# EAGLE design leg_controller (EAGLE 7.7.0)
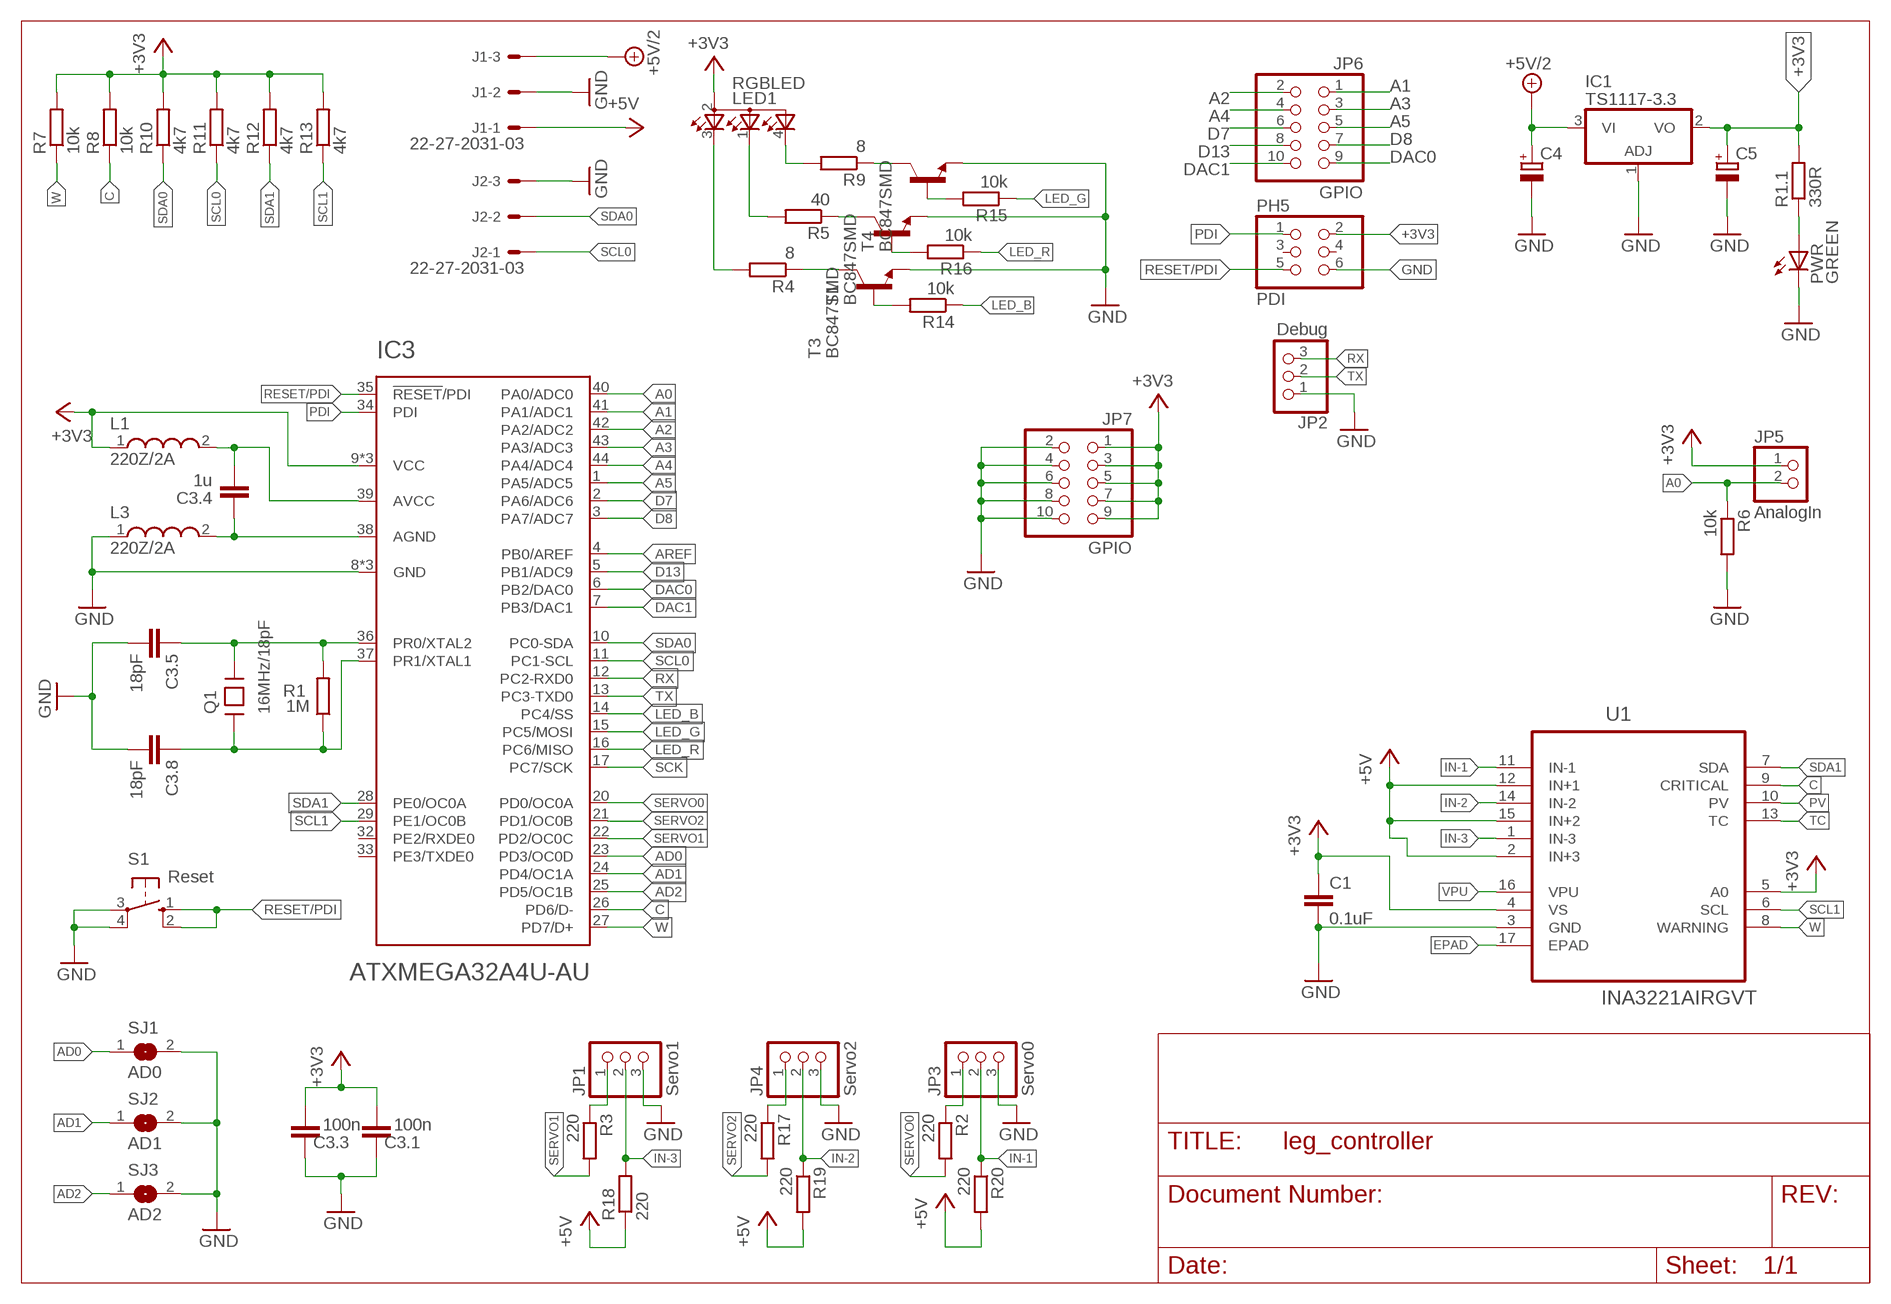
[diagram p0: schematic, sheet 1]

## Parts
C1  0.1uF  C-EUC0805  [C0805]
C3.1  100n  C-EUC0805K  [C0805K]
C3.3  100n  C-EUC0805K  [C0805K]
C3.4  1u  C-EUC0805K  [C0805K]
C3.5  18pF  C-EUC0805K  [C0805K]
C3.8  18pF  C-EUC0805K  [C0805K]
C4  CPOL-EUSMCA  [SMC_A]
C5  CPOL-EUSMCA  [SMC_A]
IC1  TS1117-3.3  MC33269D-3.3  [DPACK]
IC3  ATXMEGA32A4U-AU  [TQFP-44A-44]
J1  22-27-2031-03  [6410-03]
J2  22-27-2031-03  [6410-03]
JP1  Servo1  PINHD-1X3  [1X03]
JP2  Debug  PINHD-1X3  [1X03]
JP3  Servo0  PINHD-1X3  [1X03]
JP4  Servo2  PINHD-1X3  [1X03]
JP5  AnalogIn  PINHD-1X2  [1X02]
JP6  GPIO  PINHD-2X5  [2X05]
JP7  GPIO  PINHD-2X5  [2X05]
L1  220Z/2A  WE-CBF_0805(WB/HS)  [WE-CBF_0805(W=3.0)]
L3  220Z/2A  WE-CBF_0805(WB/HS)  [WE-CBF_0805(W=3.0)]
LED1  RGBLED  [P-LCC4-RGB]
PH5  PDI  PINHD-2X3  [2X03]
PWR  GREEN  LEDCHIP-LED0805  [CHIP-LED0805]
Q1  16MHz/18pF  CRYSTAL-ABRACON-ABM3-SMD  [CRYSTAL-ABRACON-ABM3-SMD]
R1  1M  R-EU_R0805  [R0805]
R1.1  330R  R-EU_R0805  [R0805]
R2  220  R-EU_R0805  [R0805]
R3  220  R-EU_R0805  [R0805]
R4  8  R-EU_R0805  [R0805]
R5  40  R-EU_R0805  [R0805]
R6  10k  R-EU_M0805  [M0805]
R7  10k  R-EU_R0805  [R0805]
R8  10k  R-EU_R0805  [R0805]
R9  8  R-EU_R0805  [R0805]
R10  4k7  R-EU_R0805  [R0805]
R11  4k7  R-EU_R0805  [R0805]
R12  4k7  R-EU_R0805  [R0805]
R13  4k7  R-EU_R0805  [R0805]
R14  10k  R-EU_R0805  [R0805]
R15  10k  R-EU_R0805  [R0805]
R16  10k  R-EU_R0805  [R0805]
R17  220  R-EU_R0805  [R0805]
R18  220  R-EU_R1206  [R1206]
R19  220  R-EU_R1206  [R1206]
R20  220  R-EU_R1206  [R1206]
S1  Reset  10-XX  [B3F-10XX]
SJ1  AD0  SJ  [SJ]
SJ2  AD1  SJ  [SJ]
SJ3  AD2  SJ  [SJ]
T1  BC847SMD  [SOT23]
T3  BC847SMD  [SOT23]
T4  BC847SMD  [SOT23]
U1  INA3221AIRGVT  [QFN65P400X400X80-17N]

## Nets
+3V3: C1.1 C3.1.1 C3.3.1 C5.+ IC1.2(VO) IC3.9(VCC) IC3.19(VCC) IC3.31(VCC) JP5.1 JP7.1 JP7.3 JP7.5 JP7.7 JP7.9 L1.1 LED1.2(A2) PH5.2 R1.1.2 R7.2 R8.2 R10.2 R11.2 R12.2 R13.2 U1.4(VS) U1.5(A0)
+5V: J1.1 R18.1 R19.2 R20.2 U1.2(IN+3) U1.12(IN+1) U1.15(IN+2)
+5V/2: C4.+ IC1.3(VI) J1.3
A0: IC3.40(PA0/ADC0) JP5.2 R6.1
A1: IC3.41(PA1/ADC1) JP6.1
A2: IC3.42(PA2/ADC2) JP6.2
A3: IC3.43(PA3/ADC3) JP6.3
A4: IC3.44(PA4/ADC4) JP6.4
A5: IC3.1(PA5/ADC5) JP6.5
AD0: IC3.23(PD3/OC0D) SJ1.1
AD1: IC3.24(PD4/OC1A) SJ2.1
AD2: IC3.25(PD5/OC1B) SJ3.1
AGND: C3.4.2 IC3.38(AGND) L3.2
AREF: IC3.4(PB0/AREF)
C: IC3.26(PD6/D-) R8.1 U1.9(CRITICAL)
D7: IC3.2(PA6/ADC6) JP6.6
D8: IC3.3(PA7/ADC7) JP6.7
D13: IC3.5(PB1/ADC9) JP6.8
DAC0: IC3.6(PB2/DAC0) JP6.9
DAC1: IC3.7(PB3/DAC1) JP6.10
EPAD: U1.17(EPAD)
GND: C1.2 C3.1.2 C3.3.2 C3.5.2 C3.8.2 C4.- C5.- IC1.1(ADJ) IC3.8(GND) IC3.18(GND) IC3.30(GND) J1.2 J2.3 JP1.3 JP2.1 JP3.3 JP4.3 JP7.2 JP7.4 JP7.6 JP7.8 JP7.10 L3.1 PH5.6 PWR.C R6.2 S1.3(P) S1.4(P1) SJ1.2 SJ2.2 SJ3.2 T1.2(E) T3.2(E) T4.2(E) U1.3(GND)
IN-1: JP3.2 R20.1 U1.11(IN-1)
IN-2: JP4.2 R19.1 U1.14(IN-2)
IN-3: JP1.2 R18.2 U1.1(IN-3)
LED_B: IC3.14(PC4/SS) R14.1
LED_G: IC3.15(PC5/MOSI) R15.1
LED_R: IC3.16(PC6/MISO) R16.1
N$8: C3.4.1 IC3.39(AVCC) L1.2
N$13: R5.1 T1.3(C)
N$14: R4.1 T3.3(C)
N$15: R9.1 T4.3(C)
N$16: PWR.A R1.1.1
N$17: LED1.3(CRED) R4.2
N$18: JP3.1 R2.1
N$19: JP1.1 R3.1
N$20: LED1.1(CBLUE) R5.2
N$21: LED1.4(CGREEN) R9.2
N$22: JP4.1 R17.1
N$27: R14.2 T3.1(B)
N$28: R15.2 T4.1(B)
N$29: R16.2 T1.1(B)
PDI: IC3.34(PDI) PH5.1
PV: U1.10(PV)
RESET/PDI: IC3.35(!RESET!/PDI) PH5.5 S1.1(S) S1.2(S1)
RX: IC3.12(PC2-RXD0) JP2.3
SCK: IC3.17(PC7/SCK)
SCL0: IC3.11(PC1-SCL) J2.1 R11.1
SCL1: IC3.29(PE1/OC0B) R13.1 U1.6(SCL)
SDA0: IC3.10(PC0-SDA) J2.2 R10.1
SDA1: IC3.28(PE0/OC0A) R12.1 U1.7(SDA)
SERVO0: IC3.20(PD0/OC0A) R2.2
SERVO1: IC3.22(PD2/OC0C) R3.2
SERVO2: IC3.21(PD1/OC0B) R17.2
TC: U1.13(TC)
TX: IC3.13(PC3-TXD0) JP2.2
VPU: U1.16(VPU)
W: IC3.27(PD7/D+) R7.1 U1.8(WARNING)
XTAL1R: C3.8.1 IC3.37(PR1/XTAL1) Q1.P$1 R1.1
XTAL2: C3.5.1 IC3.36(PR0/XTAL2) Q1.P$2 R1.2
Unconnected: IC3.32(PE2/RXDE0) IC3.33(PE3/TXDE0) PH5.3 PH5.4

## Library data of the parts
C1 C3.1 C3.3-C3.5 C3.8 = rcl:C-EU: CAPACITOR, European symbol
C4 C5 = rcl:CPOL-EU: POLARIZED CAPACITOR, European symbol
IC1 = linear:MC33269?*: Adjustable Output Low Dropout Voltage Regulator 800 mA Source: http://www.onsemi.com/pub/Collateral/MC33269-D.PDF
IC3 = atmel-xmega:ATXMEGA32A4U: 8/16-bit XMEGA A4U Microcontroller Features High-performance, low-power Atmel® AVR® XMEGA® 8/16-bit Microcontroller Nonvolatile program and data memories – 16K - 128KBytes of in-system self-programmable flash – 4K - 8KBytes boot section – 1K - 2KBytes EEPROM – 2K - 8KBytes internal SRAM Peripheral Features – Four-channel DMA controller – Eight-channel event system – Five 16-bit timer/counters Three timer/counters with 4 output compare or input capture channels Two timer/counters with 2 output compare or input capture channels High-resolution extensions on all timer/counters Advanced waveform extension (AWeX) on one timer/counter – One USB device interface USB 2.0 full speed (12Mbps) and low speed (1.5Mbps) device compliant 32 Endpoints with full configuration flexibility – Five USARTs with IrDA support for one USART – Two Two-wire interfaces with dual address match (I2C and SMBus compatible) – Two serial peripheral interfaces (SPIs) – AES and DES crypto engine – CRC-16 (CRC-CCITT) and CRC-32 (IEEE® 802.3) generator – 16-bit real time counter (RTC) with separate oscillator – One twelve-channel, 12-bit, 2mspsAnalog to Digital Converter – One two-channel, 12-bit, 1msps Digital to Analog Converter – Two Analog Comparators with window compare function, and current sources – External interrupts on all general purpose I/O pins – Programmable watchdog timer with separate on-chip ultra low power oscillator – QTouch® library support Capacitive touch buttons, sliders and wheels Special microcontroller features – Power-on reset and programmable brown-out detection – Internal and external clock options with PLL and prescaler – Programmable multilevel interrupt controller – Five sleep modes – Programming and debug interfaces PDI (program and debug interface) I/O and packages – 34 Programmable I/O pins – 44 - lead TQFP – 44 - pad VQFN/QFN – 49 - ball VFBGA Operating voltage – 1.6 – 3.6V Operating frequency – 0 – 12MHz from 1.6V – 0 – 32MHz from 2.7V
J1 J2 = con-molex:22-?-03: CONNECTOR wire to board 2.54 mm (.1 inch) pitch header; OC_FARNELL: unknown; OC_NEWARK: unknown
JP1 JP3 JP4 = pinhead:PINHD-1X3: PIN HEADER
JP2 = pinhead_NEW:PINHD-1X3: PIN HEADER
JP5 = pinhead:PINHD-1X2: PIN HEADER
JP6 JP7 = pinhead:PINHD-2X5: PIN HEADER
L1 L3 = Wurth_Elektronik_Passive_rev15d:WE-CBF: WE-CBF SMD EMI Suppression Ferrite Bead Characteristics Reliable Ni-Sn electrodes High rated current up to 6 A Operating temperature: –55 ºC to +125 ºC Applications Perfect as data lined filter and for uncoupling of distribution voltage Variant abbreviation WB means WIDE BAND HS means HIGH SPEED HC means HIGH CURRENT <http://katalog.we-online.de/media/images/eisos/FeCBF_pf2.jpg> Details see: http://katalog.we-online.de/en/pbs/WE-CBF Updated on 2014-06-19 2014 (C) Wurth Elektronik
LED1 = led:RGBLED
PH5 = pinhead:PINHD-2X3: PIN HEADER
PWR = led:LED: LED OSRAM: - CHIPLED LG R971, LG N971, LY N971, LG Q971, LY Q971, LO R971, LY R971 LH N974, LH R974 LS Q976, LO Q976, LY Q976 LO Q996 - Hyper CHIPLED LW Q18S LB Q993, LB Q99A, LB R99A - SideLED LS A670, LO A670, LY A670, LG A670, LP A670 LB A673, LV A673, LT A673, LW A673 LH A674 LY A675 LS A676, LA A676, LO A676, LY A676, LW A676 LS A679, LY A679, LG A679 - Hyper Micro SIDELED® LS Y876, LA Y876, LO Y876, LY Y876 LT Y87S - SmartLED LW L88C, LW L88S LB L89C, LB L89S, LG L890 LS L89K, LO L89K, LY L89K LS L896, LA L896, LO L896, LY L896 - TOPLED LS T670, LO T670, LY T670, LG T670, LP T670 LSG T670, LSP T670, LSY T670, LOP T670, LYG T670 LG T671, LOG T671, LSG T671 LB T673, LV T673, LT T673, LW T673 LH T674 LS T676, LA T676, LO T676, LY T676, LB T676, LH T676, LSB T676, LW T676 LB T67C, LV T67C, LT T67C, LS T67K, LO T67K, LY T67K, LW E67C LS E67B, LA E67B, LO E67B, LY E67B, LB E67C, LV E67C, LT E67C LW T67C LS T679, LY T679, LG T679 LS T770, LO T770, LY T770, LG T770, LP T770 LB T773, LV T773, LT T773, LW T773 LH T774 LS E675, LA E675, LY E675, LS T675 LS T776, LA T776, LO T776, LY T776, LB T776 LHGB T686 LT T68C, LB T68C - Hyper Mini TOPLED® LB M676 - Mini TOPLED Santana® LG M470 LS M47K, LO M47K, LY M47K Source: http://www.osram.convergy.de LUXEON: - LUMILED® LXK2-PW12-R00, LXK2-PW12-S00, LXK2-PW14-U00, LXK2-PW14-V00 LXK2-PM12-R00, LXK2-PM12-S00, LXK2-PM14-U00 LXK2-PE12-Q00, LXK2-PE12-R00, LXK2-PE12-S00, LXK2-PE14-T00, LXK2-PE14-U00 LXK2-PB12-K00, LXK2-PB12-L00, LXK2-PB12-M00, LXK2-PB14-N00, LXK2-PB14-P00, LXK2-PB14-Q00 LXK2-PR12-L00, LXK2-PR12-M00, LXK2-PR14-Q00, LXK2-PR14-R00 LXK2-PD12-Q00, LXK2-PD12-R00, LXK2-PD12-S00 LXK2-PH12-R00, LXK2-PH12-S00 LXK2-PL12-P00, LXK2-PL12-Q00, LXK2-PL12-R00 Source: www.luxeon.com KINGBRIGHT: KA-3528ASYC Source: www.kingbright.com
Q1 = crystal-abracon-abm3-smd:CRYSTAL-ABRACON-ABM3-SMD: ABRACON ABM3-8.000MHZ-D2Y-T QUARZ 8MHZ 18PF SMD, 5mm x 3.2mm Frequenzstabilität + / -: 30ppm Frequenztoleranz + / -: 20ppm; FARNELL: 2101329
R1 R1.1 R2-R20 = rcl:R-EU_: RESISTOR, European symbol
S1 = switch-omron:10-XX: OMRON SWITCH; MPN: B3F-1000; OC_FARNELL: 176432; OC_NEWARK: 36M3542
SJ1-SJ3 = jumper:SJ: SMD solder JUMPER
T1 T3 T4 = transistor-npn:BC847*: NPN Transistor
U1 = TexasInstruments:INA3221AIRGVT: MONITOR, 3CH, HS, 0V TO 26VSENSE, 16QFN; MPN: INA3221AIRGVT; OC_FARNELL: 2144251; OC_NEWARK: 27W5216; PACKAGE: 16QFN; SUPPLIER: TEXAS INSTRUMENTS

## Board
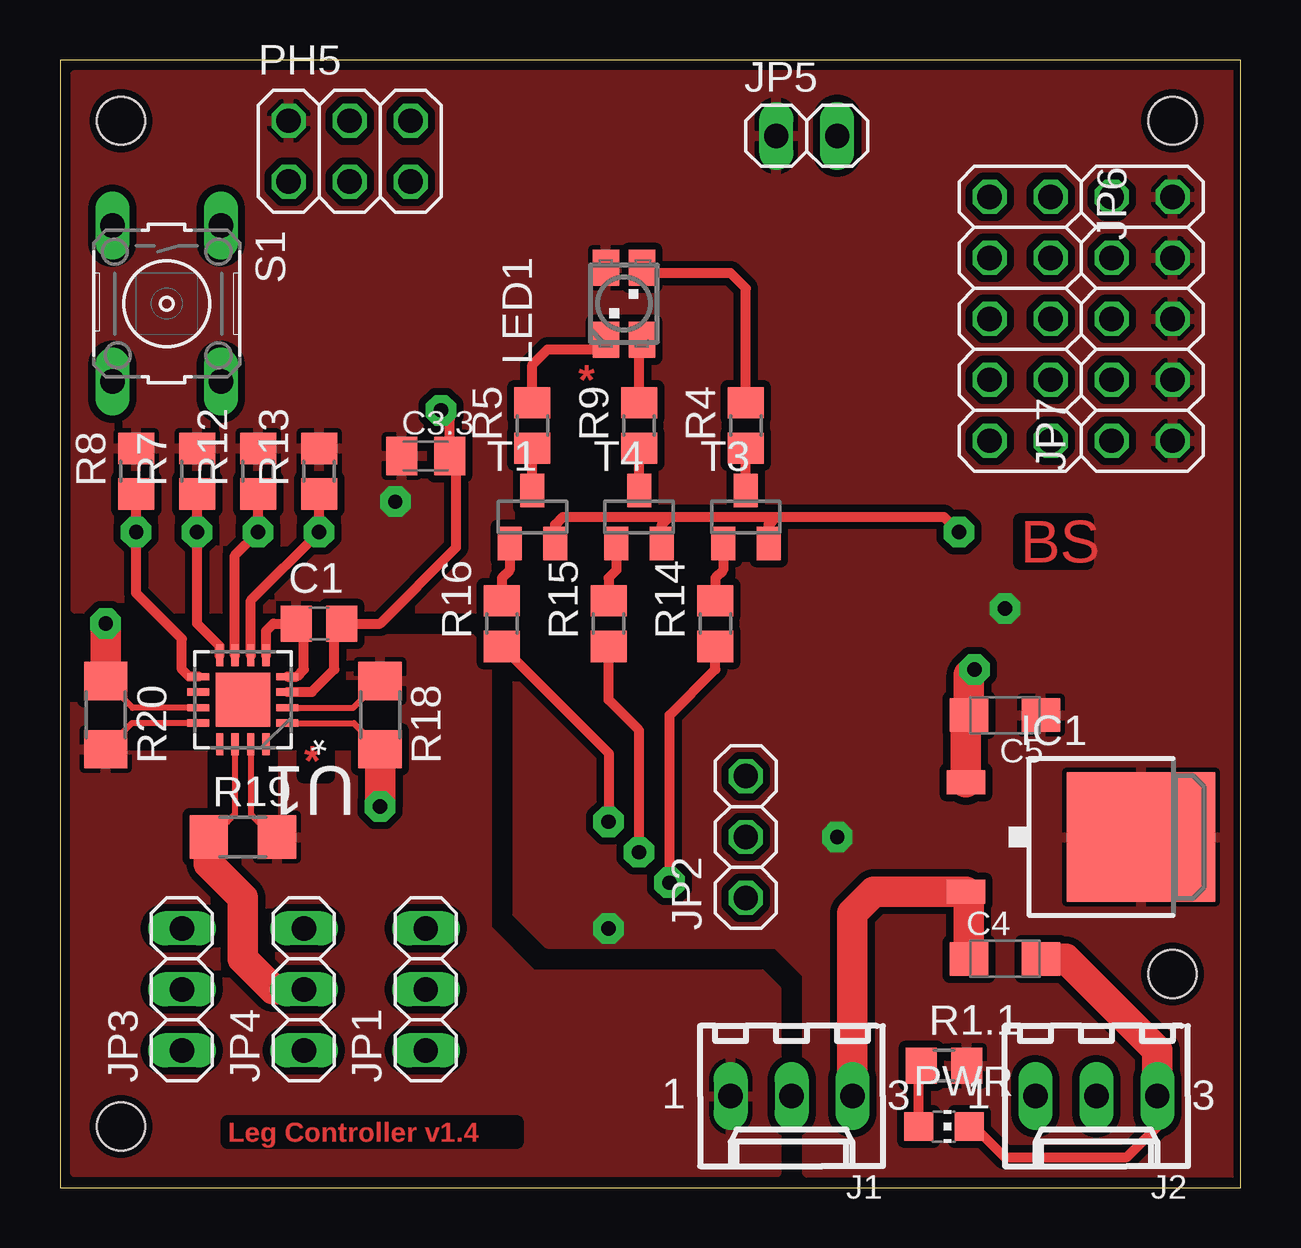
[diagram p1: board, top side]
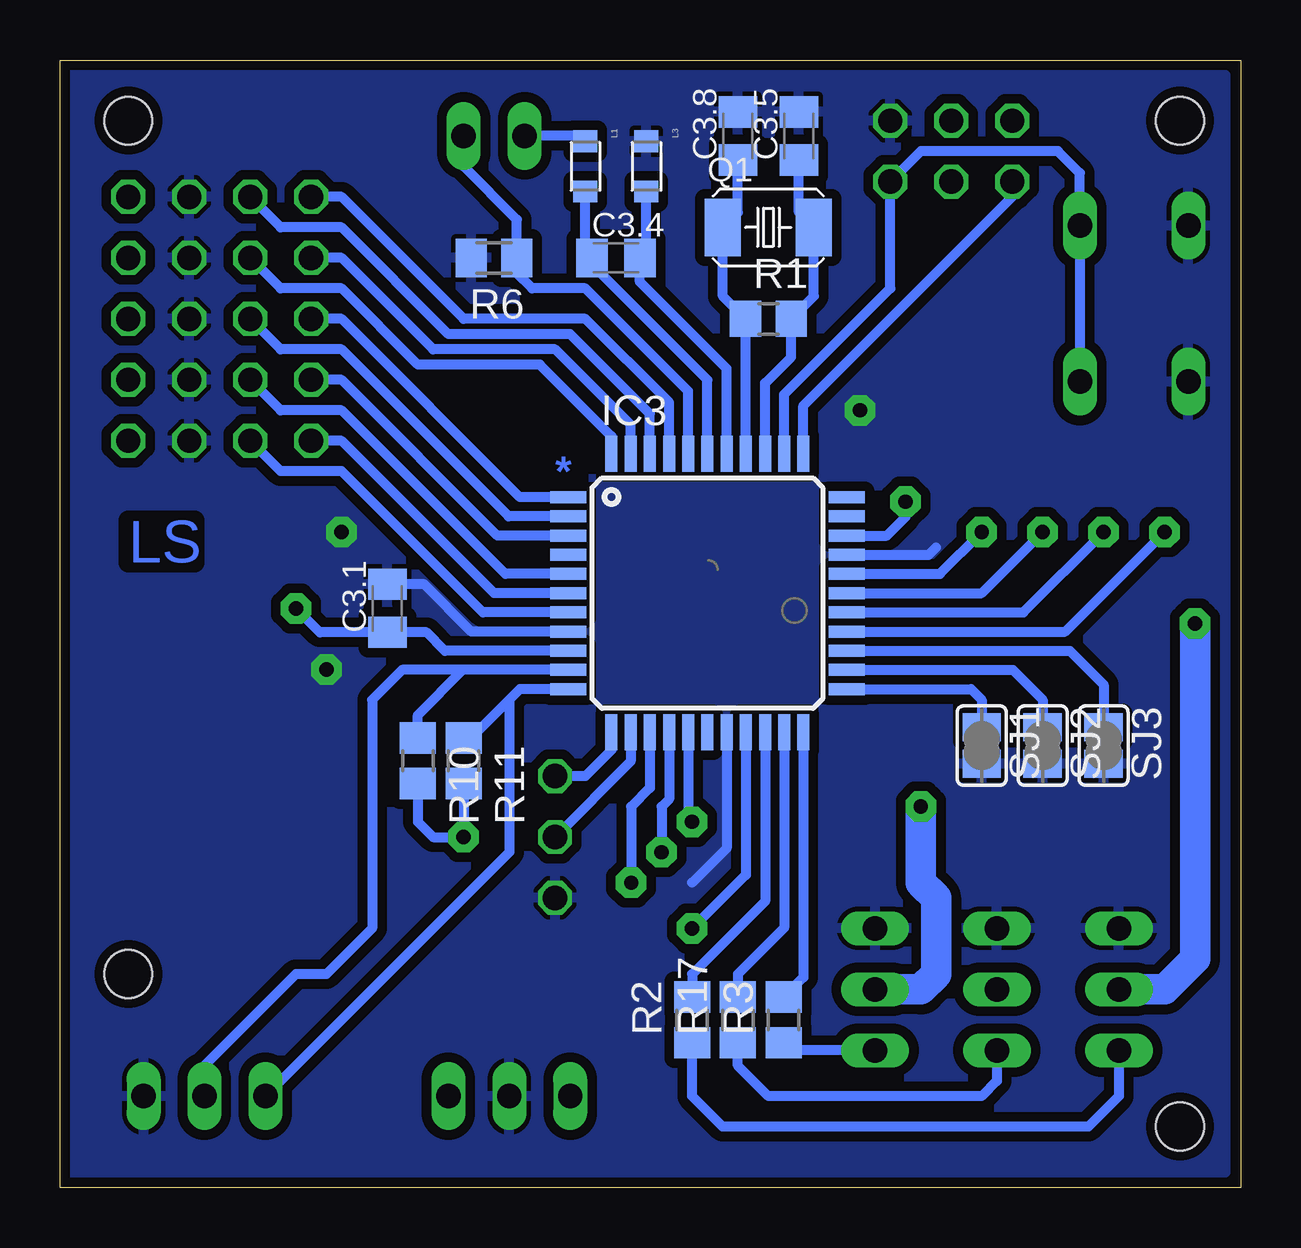
[diagram p2: board, bottom side, seen from below]

Size 49.2 x 46.98 mm. Coordinates in mm from the lower left corner, seen from the top.
Outline: 0,0 49.2,0 49.2,46.98 0,46.98 0,0
Copper layers (1*16): Top 0.035mm / dielectric 1.5mm / Bottom 0.035mm
Design rules "PCB-POOL Standard": minimum track width 0.15mm, minimum drill 0.3mm, track to track 0.15mm, track to pad 0.15mm, pad to pad 0.15mm, via to via 0.15mm, smd to smd 0.15mm, copper to edge 0.3mm, drill to drill 0.2mm, minimum pad ring 0.2mm, minimum via ring 0.15mm, stop-mask expansion 0.075mm, vias tented up to drill 0mil, thermal gap 0.2mm
Holes 2 mm at 2.54,2.54 46.35,44.45 2.54,44.45 46.35,8.89

### Footprints (pad centres in the part's own frame; a part is rotated, then mirrored left to right if it is on the bottom)
C0805 = smd 1.3 x 1.5: 1 -0.95,0; 2 0.95,0
C0805K = smd 1.3 x 1.6: 1 -1,0; 2 1,0
SMC_A = smd 1.6 x 1.4: + -1.5,0; - 1.5,0
DPACK = smd 1 x 1.6: 1 -2.28,-4.8; 3 2.28,-4.8 | smd 5.4 x 6.2: 2 0,2.5
TQFP-44A-44 = smd 1.5 x 0.5: 1 -5.8,4; 2 -5.8,3.2; 3 -5.8,2.4; 4 -5.8,1.6; 5 -5.8,0.8; 6 -5.8,0; 7 -5.8,-0.8; 8 -5.8,-1.6; 9 -5.8,-2.4; 10 -5.8,-3.2; 11 -5.8,-4; 23 5.8,-4; 24 5.8,-3.2; 25 5.8,-2.4; 26 5.8,-1.6; 27 5.8,-0.8; 28 5.8,0; 29 5.8,0.8; 30 5.8,1.6; 31 5.8,2.4; 32 5.8,3.2; 33 5.8,4 | smd 0.5 x 1.5: 12 -4,-5.8; 13 -3.2,-5.8; 14 -2.4,-5.8; 15 -1.6,-5.8; 16 -0.8,-5.8; 17 0,-5.8; 18 0.8,-5.8; 19 1.6,-5.8; 20 2.4,-5.8; 21 3.2,-5.8; 22 4,-5.8; 34 4,5.8; 35 3.2,5.8; 36 2.4,5.8; 37 1.6,5.8; 38 0.8,5.8; 39 0,5.8; 40 -0.8,5.8; 41 -1.6,5.8; 42 -2.4,5.8; 43 -3.2,5.8; 44 -4,5.8
6410-03 = drill 1.016 long: 1 2.54,0; 2 0,0; 3 -2.54,0
1X03 = drill 1.016 long: 1 -2.54,0; 2 0,0; 3 2.54,0
1X03' = drill 1.016 octagon: 1 -2.54,0; 2 0,0; 3 2.54,0
1X02 = drill 1.016 long: 1 -1.27,0; 2 1.27,0
2X05 = drill 1.016 octagon: 1 -5.08,-1.27; 2 -5.08,1.27; 3 -2.54,-1.27; 4 -2.54,1.27; 5 0,-1.27; 6 0,1.27; 7 2.54,-1.27; 8 2.54,1.27; 9 5.08,-1.27; 10 5.08,1.27
WE-CBF_0805(W=3.0) = smd 0.9 x 1: 1 -1.05,0; 2 1.05,0
P-LCC4-RGB = smd 1.1 x 1.5: 1 -0.75,-1.5; 2 -0.75,1.5; 3 0.75,1.5; 4 0.75,-1.5
2X03 = drill 1.016 octagon: 1 -2.54,-1.27; 2 -2.54,1.27; 3 0,-1.27; 4 0,1.27; 5 2.54,-1.27; 6 2.54,1.27
CHIP-LED0805 = smd 1.2 x 1.2: A 0,-1.05; C 0,1.05
CRYSTAL-ABRACON-ABM3-SMD = smd 1.5 x 2.4: P$1 -1.9,0; P$2 1.9,0
R0805 = smd 1.3 x 1.5: 1 -0.95,0; 2 0.95,0
M0805 = smd 1.3 x 1.6: 1 -0.95,0; 2 0.95,0
R1206 = smd 1.6 x 1.803: 1 -1.422,0; 2 1.422,0
B3F-10XX = drill 1.016 long: 1 -3.251,2.261; 2 3.251,2.261; 3 -3.251,-2.261; 4 3.251,-2.261
SJ = smd 1.168 x 1.6: 1 -0.762,0; 2 0.762,0
SOT23 = smd 1 x 1.4: 1 -0.95,-1.1; 2 0.95,-1.1; 3 0,1.1
QFN65P400X400X80-17N = smd 0.914 x 0.305: 1 -1.854,0.965; 2 -1.854,0.33; 3 -1.854,-0.33; 4 -1.854,-0.965; 9 1.854,-0.965; 10 1.854,-0.33; 11 1.854,0.33; 12 1.854,0.965 | smd 0.305 x 0.914: 5 -0.965,-1.854; 6 -0.33,-1.854; 7 0.33,-1.854; 8 0.965,-1.854; 13 0.965,1.854; 14 0.33,1.854; 15 -0.33,1.854; 16 -0.965,1.854 | smd 2.261 x 2.261: 17 0,0

### Placement (x,y rotation side)
C1  10.79,23.5 0 top
C3.1  35.56,24.13 90 bottom
C3.3  15.24,30.48 0 top
C3.4  26.04,38.73 0 bottom
C3.5  18.41,43.81 90 bottom
C3.8  20.95,43.81 90 bottom
C4  39.37,9.53 0 top
C5  39.37,19.68 180 top
IC1  42.55,14.61 270 top
IC3  22.23,24.77 0 bottom
J1  30.48,3.81 180 top
J2  43.18,3.81 180 top
JP1  15.24,8.26 90 top
JP2  Debug  [1X03']  28.57,14.61 90 top
JP3  5.08,8.26 90 top
JP4  10.16,8.26 90 top
JP5  31.11,43.81 0 top
JP6  40.01,36.2 270 top
JP7  45.09,36.2 90 top
L1  27.3,42.55 270 bottom
L3  24.77,42.55 270 bottom
LED1  23.5,36.83 0 top
PH5  12.06,43.18 0 top
PWR  36.83,2.54 270 top
Q1  19.68,40.01 0 bottom
R1  19.68,36.2 0 bottom
R1.1  36.83,5.08 0 top
R2  22.86,6.99 90 bottom
R3  19.05,6.99 90 bottom
R4  28.57,31.75 90 top
R5  19.68,31.75 90 top
R6  31.11,38.73 180 bottom
R7  5.71,29.84 90 top
R8  3.17,29.84 90 top
R9  24.13,31.75 90 top
R10  34.29,17.78 270 bottom
R11  32.38,17.78 270 bottom
R12  8.26,29.84 90 top
R13  10.79,29.84 90 top
R14  27.3,23.5 90 top
R15  22.86,23.5 90 top
R16  18.41,23.5 90 top
R17  20.95,6.99 90 bottom
R18  13.34,19.68 270 top
R19  7.62,14.61 0 top
R20  1.91,19.68 270 top
S1  4.45,36.83 270 top
SJ1  10.79,18.41 270 bottom
SJ2  8.26,18.41 270 bottom
SJ3  5.71,18.41 270 bottom
T1  19.68,27.94 0 top
T3  28.57,27.94 0 top
T4  24.13,27.94 0 top
U1  7.62,20.32 180 top

### Tracks (layer width: path | path; a pad name or v marks a point on that pad's centre or on a via)
+3V3  (via drill 0.6 pad 1.27)
  Top 0.406: U1.5 8.59,23.19 8.89,23.5 C1.1 10.16,23.18 10.16,21.59 9.86,21.29 U1.4
  Bottom 0.406: L1.1 27.52,43.81 JP5.1 | IC3.9 33.16,22.36 33.92,23.13 C3.1.1 38.37,23.13 v39.37,24.13 | R11.2 v32.38,14.61 33.66,14.61 34.29,15.24 R10.2 | IC3.19 20.62,13.03 v22.86,10.79 | IC3.31 14.74,27.16 13.97,27.94 v13.97,28.57
  pour Top (isolate 0.305): 0.64,24.13 17.78,24.13 19.05,22.23 19.05,11.43 20.32,10.16 29.84,10.16 31.11,8.89 31.11,0.64 48.9,0.64 48.9,46.35 0.64,46.35
+5V
  Top 0.254: R18.1 12.22,19.99 U1.2 | U1.12 3,19.36 R20.2 | U1.15 7.95,15.54 8.26,15.24 8.41,15.24 R19.2
  pour Top (isolate 0.305): 0.64,22.86 17.14,22.86 17.78,21.59 17.78,10.79 19.68,8.89 29.21,8.89 29.84,8.26 29.84,0.64 0.64,0.64
+5V/2
  Top 1.27: J1.3 33.02,11.43 33.91,12.32 IC1.3 37.87,12.2 C4.+
A0
  Bottom 0.406: IC3.40 23.02,33.19 27.3,37.47 29.52,37.47 30.16,38.1 R6.1 30.16,40.33 32.38,42.55 JP5.2
A1
  Bottom 0.406: IC3.41 23.82,32.72 27.3,36.2 32.38,36.2 37.47,41.27 JP6.1
A2
  Bottom 0.406: IC3.42 24.62,32.24 27.94,35.56 33.02,35.56 37.47,40.01 40.01,40.01 JP6.2
A3
  Bottom 0.406: IC3.43 25.43,31.77 28.57,34.92 33.66,34.92 37.47,38.73 JP6.3
A4
  Bottom 0.406: IC3.44 26.23,31.3 29.21,34.29 34.29,34.29 37.47,37.47 40.01,37.47 JP6.4
A5
  Bottom 0.406: IC3.1 30.04,28.77 37.47,36.2 JP6.5
AD0
  Bottom 0.406: IC3.23 11.24,20.77 10.79,20.32 SJ1.1
AD1
  Bottom 0.406: IC3.24 9.5,21.57 8.26,20.32 SJ2.1
AD2
  Bottom 0.406: IC3.25 7.12,22.36 5.71,20.95 SJ3.1
AGND
  Bottom 0.406: L3.2 24.77,39.01 C3.4.2 25.04,37.73 21.43,34.12 IC3.38
C  (via drill 0.6 pad 1.27)
  Top 0.406: U1.9 5.38,21.29 5.08,21.59 5.08,22.86 3.17,24.77 v3.17,27.3 R8.1
  Bottom 0.406: IC3.26 7.32,23.16 v3.17,27.3
D7
  Bottom 0.406: IC3.2 30.5,27.96 37.47,34.92 40.01,34.92 JP6.6
D8
  Bottom 0.406: IC3.3 30.98,27.16 37.47,33.66 JP6.7
D13
  Bottom 0.406: IC3.5 30.64,25.57 37.47,32.38 40.01,32.38 JP6.8
DAC0
  Bottom 0.406: IC3.6 31.11,24.77 37.47,31.11 JP6.9
DAC1
  Bottom 0.406: IC3.7 31.59,23.96 37.47,29.84 40.01,29.84 JP6.10
GND  (via drill 0.6 pad 1.27)
  Top 0.406: U1.3 10.49,20.65 11.43,21.59 11.43,23.18 C1.2 13.34,23.5 16.51,26.67 16.51,30.21 C3.3.2 16.24,32.02 v15.88,32.38 | T1.2 20.64,27.62 20.95,27.94 25.4,27.94 | 25.4,27.94 29.84,27.94 | 29.84,27.94 36.83,27.94 v37.47,27.3 | T4.2 25.08,27.62 25.4,27.94 | T3.2 29.52,27.62 29.84,27.94 | PWR.C 38.1,2.54 39.37,1.27 44.45,1.27 45.72,2.54 J2.3
  Top 1.27: IC1.1 37.74,19.56 C5.- 37.87,21.36 v38.1,21.59 | C4.- 41.91,9.53 45.72,5.71 J2.3
  Bottom 0.406: IC3.8 32.05,23.16 34.02,25.13 C3.1.2 | IC3.30 13.01,26.36 12.7,26.67 | IC3.18 21.43,14.13 22.86,12.7
  pour Bottom (isolate 0.406): 0.64,46.35 48.9,46.35 48.9,0.64 0.64,0.64
IN-1  (via drill 0.6 pad 1.27)
  Top 0.254: R20.1 3.02,19.99 U1.11
  Top 1.27: v1.91,23.5 R20.1
  Bottom 1.27: JP3.2 3.17,8.26 1.91,9.53 v1.91,23.5
IN-2
  Top 0.254: U1.14 7.29,15.54 6.99,15.24 6.83,15.24 R19.1
  Top 1.27: R19.1 6.2,13.49 7.62,12.06 7.62,9.53 8.89,8.26 JP4.2
IN-3  (via drill 0.6 pad 1.27)
  Top 0.254: R18.2 12.24,19.36 U1.1
  Top 1.27: R18.2 v13.34,15.88
  Bottom 1.27: v13.34,15.88 13.34,12.7 12.7,12.06 12.7,8.89 13.34,8.26 JP1.2
LED_B  (via drill 0.6 pad 1.27)
  Top 0.406: v25.4,12.7 25.4,19.68 27.3,21.59 R14.1
  Bottom 0.406: IC3.14 24.62,16.65 25.4,15.88 v25.4,12.7
LED_G  (via drill 0.6 pad 1.27)
  Top 0.406: v24.13,13.97 24.13,19.05 22.86,20.32 R15.1
  Bottom 0.406: IC3.15 23.82,16.18 24.13,15.88 v24.13,13.97
LED_R  (via drill 0.6 pad 1.27)
  Top 0.406: R16.1 22.86,18.1 v22.86,15.24
  Bottom 0.406: IC3.16 23.02,15.4 v22.86,15.24
N$1
  cutout Top: 1.27,20.95 13.97,20.95 13.97,18.41 1.27,18.41
N$2
  cutout Top: 6.35,19.05 6.35,13.97 8.89,13.97 8.89,19.05
N$8
  Bottom 0.406: L1.2 27.3,39.01 C3.4.1 27.04,38.47 22.23,33.66 IC3.39
N$13
  Top 0.406: T1.3 R5.1
N$14
  Top 0.406: T3.3 R4.1
N$15
  Top 0.406: T4.3 R9.1
N$16
  Top 0.406: PWR.A 35.78,4.98 R1.1.1
N$17
  Top 0.406: R4.2 28.57,37.47 27.94,38.1 24.48,38.1 LED1.3
N$18
  Bottom 0.406: JP3.1 5.08,3.81 6.35,2.54 21.59,2.54 22.86,3.81 R2.1
N$19
  Bottom 0.406: JP1.1 18.41,5.71 19.05,6.35 R3.1
N$20
  Top 0.406: R5.2 19.68,34.29 20.32,34.92 22.34,34.92 LED1.1
N$21
  Top 0.406: R9.2 24.13,35.22 LED1.4
N$22
  Bottom 0.406: JP4.1 10.16,4.45 10.79,3.81 19.68,3.81 20.95,5.08 R17.1
N$27
  Top 0.406: T3.1 27.62,25.72 27.3,25.4 R14.2
N$28
  Top 0.406: T4.1 23.18,25.72 22.86,25.4 R15.2
N$29
  Top 0.406: T1.1 18.73,25.72 18.41,25.4 R16.2
PDI
  Bottom 0.406: IC3.34 18.23,32.58 9.53,41.27 PH5.1
RESET/PDI
  Bottom 0.406: IC3.35 19.02,33.05 14.61,37.47 PH5.5 13.34,43.18 7.62,43.18 6.71,42.27 S1.1 S1.2
RX
  Bottom 0.406: IC3.12 26.23,18.23 27.3,17.14 JP2.3
SCL0
  Bottom 0.406: IC3.11 30.04,20.77 30.48,20.32 | 30.48,20.32 30.48,13.97 J2.1 | R11.1 32.07,18.73 30.48,20.32
SCL1  (via drill 0.6 pad 1.27)
  Top 0.406: R13.1 v10.79,27.3 7.95,24.46 U1.6
  Bottom 0.406: IC3.29 12.54,25.57 v10.79,27.3
SDA0
  Bottom 0.406: IC3.10 32.41,21.57 | 32.41,21.57 34.95,21.57 36.2,20.32 36.2,10.79 38.1,8.89 39.37,8.89 43.18,5.08 J2.2 | R10.1 34.29,19.68 32.41,21.57
SDA1  (via drill 0.6 pad 1.27)
  Top 0.406: R12.1 v8.26,27.3 7.29,26.34 U1.7
  Bottom 0.406: IC3.28 10.79,24.77 v8.26,27.3
SERVO0
  Bottom 0.406: IC3.20 19.82,11.93 22.86,8.89 R2.2
SERVO1
  Bottom 0.406: IC3.22 18.23,8.76 R3.2
SERVO2
  Bottom 0.406: IC3.21 19.02,10.82 20.95,8.89 R17.2
TX
  Bottom 0.406: IC3.13 25.43,17.75 JP2.2
W  (via drill 0.6 pad 1.27)
  Top 0.406: U1.8 6.66,22.55 5.71,23.5 v5.71,27.3 R7.1
  Bottom 0.406: IC3.27 9.05,23.96 v5.71,27.3
XTAL1R
  Bottom 0.406: IC3.37 20.64,30.57 R1.1 21.59,37.15 Q1.P$1 20.95,40.63 C3.8.1
XTAL2
  Bottom 0.406: IC3.36 19.82,33.52 18.73,34.6 R1.2 17.79,37.15 Q1.P$2 18.41,40.63 C3.5.1

### Text on the board
Top: * | BS | * | Leg Controller v1.4
Bottom: * | LS